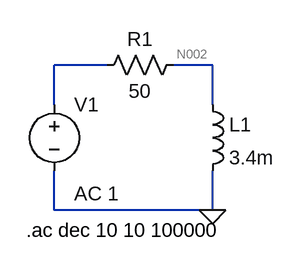
[diagram p0: schematic Task3aii.asc]
Task3aii.asc, the LTspice schematic file:
Version 4
SHEET 1 880 680
WIRE 208 80 144 80
WIRE 336 80 288 80
WIRE 144 128 144 80
WIRE 336 128 336 80
WIRE 144 256 144 208
WIRE 336 256 336 208
WIRE 336 256 144 256
FLAG 336 256 0
SYMBOL voltage 144 112 R0
WINDOW 123 24 124 Left 2
WINDOW 39 0 0 Left 0
SYMATTR Value2 AC 1
SYMATTR InstName V1
SYMATTR Value ""
SYMBOL res 304 64 R90
WINDOW 0 0 56 VBottom 2
WINDOW 3 32 56 VTop 2
SYMATTR InstName R1
SYMATTR Value 50
SYMBOL ind 320 112 R0
SYMATTR InstName L1
SYMATTR Value 3.4m
TEXT 110 280 Left 2 !.ac dec 10 10 100000

The netlist it stands for:
* Task3aii.asc
V1 N001 0 AC 1
R1 N002 N001 50
L1 N002 0 3.4m
.ac dec 10 10 100000
.backanno
.end

* Results of the author's LTspice run, read from the files saved beside the schematic
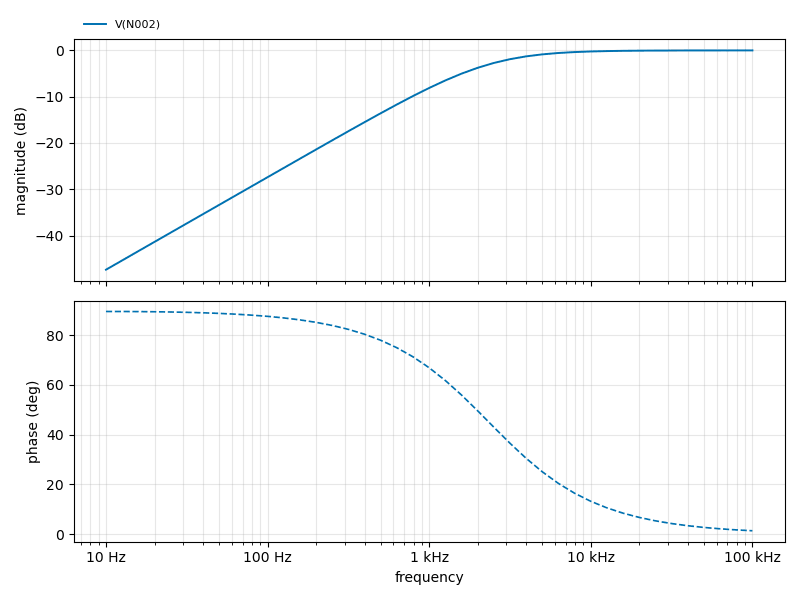
[diagram p1: AC Analysis of Task3aii.asc, plotted from the saved traces]
* AC Analysis, 1 run:
*   V(N002): -47.39 dB at 10 Hz, -0.00 dB at 100 kHz, peak -0.00 dB at 100 kHz, 3 dB below the peak at 2.352 kHz